# EAGLE design untitled (EAGLE 9.0.1)
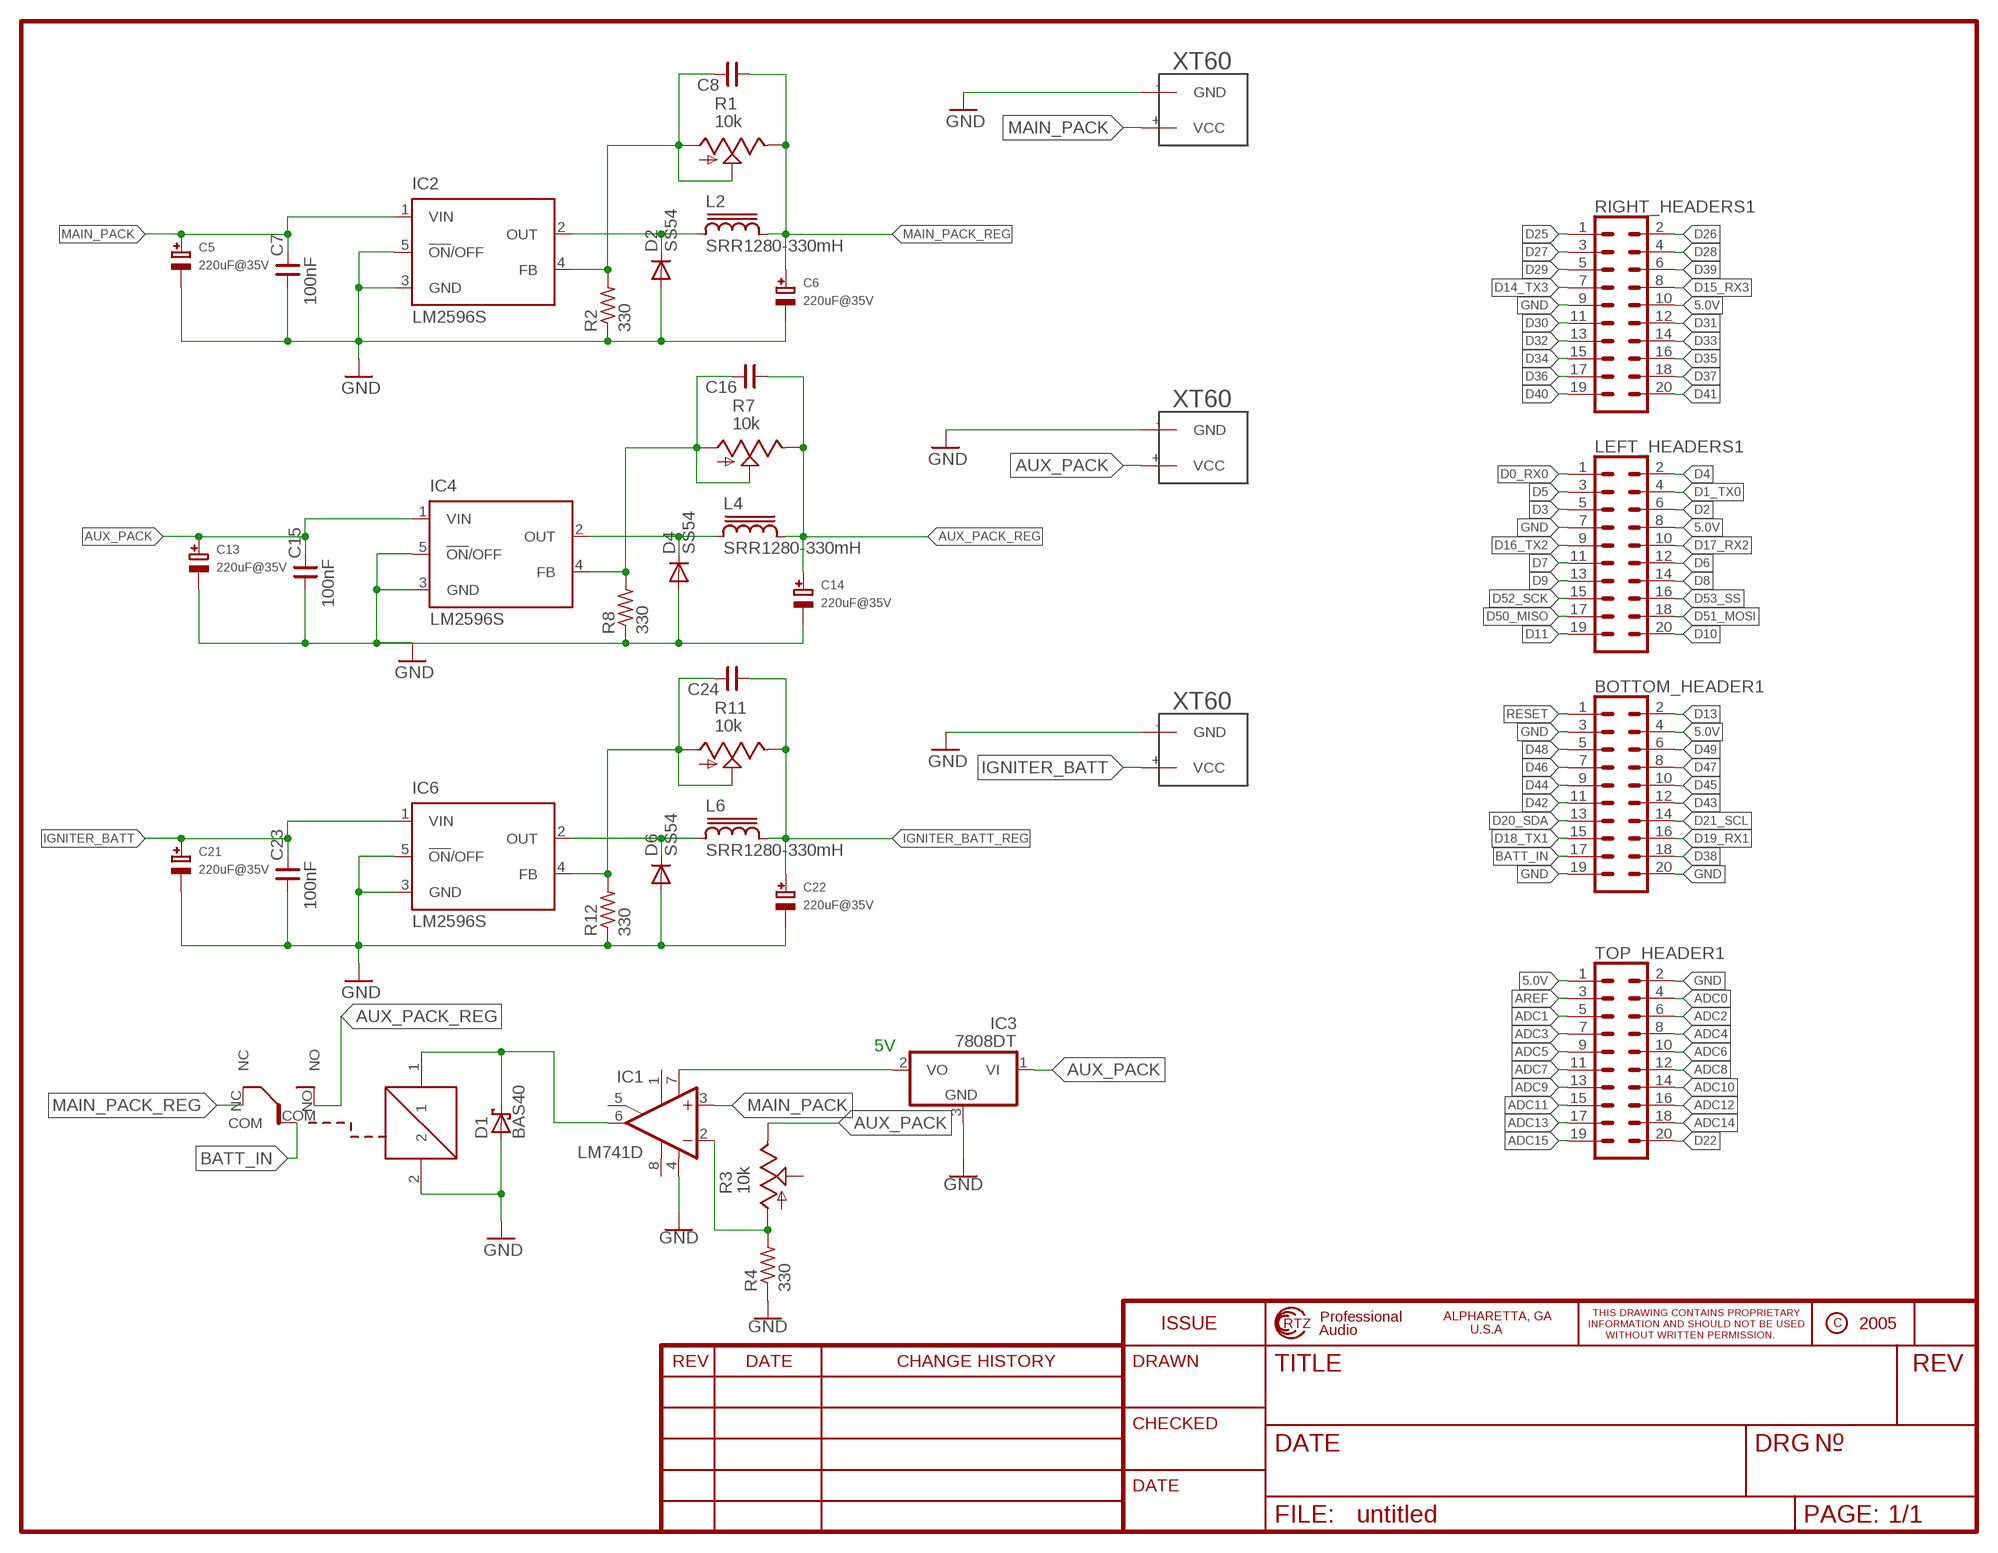
[diagram p0: schematic, sheet 1]

## Parts
BOTTOM_HEADER1  CONN_10X2  [2X10]
C5  220uF@35V  CAP_ELECTROLYTICPANASONIC_D  [PANASONIC_D]
C6  220uF@35V  CAP_ELECTROLYTICPANASONIC_D  [PANASONIC_D]
C7  100nF  CNP-0603  [0603]
C8  CNP-0603  [0603]
C13  220uF@35V  CAP_ELECTROLYTICPANASONIC_D  [PANASONIC_D]
C14  220uF@35V  CAP_ELECTROLYTICPANASONIC_D  [PANASONIC_D]
C15  100nF  CNP-0603  [0603]
C16  CNP-0603  [0603]
C21  220uF@35V  CAP_ELECTROLYTICPANASONIC_D  [PANASONIC_D]
C22  220uF@35V  CAP_ELECTROLYTICPANASONIC_D  [PANASONIC_D]
C23  100nF  CNP-0603  [0603]
C24  CNP-0603  [0603]
D1  BAS40  [SOT23]
D2  SS54  S3G  [DO214AB]
D4  SS54  S3G  [DO214AB]
D6  SS54  S3G  [DO214AB]
IC1  LM741D  [SO08]
IC2  LM2596S  [TO263-5]
IC3  7808DT  [TO252]
IC4  LM2596S  [TO263-5]
IC6  LM2596S  [TO263-5]
L2  SRR1280-330mH  SRR1280  [SRR1280]
L4  SRR1280-330mH  SRR1280  [SRR1280]
L6  SRR1280-330mH  SRR1280  [SRR1280]
LEFT_HEADERS1  CONN_10X2  [2X10]
R1  10k  TRIM_US-S64W  [S64W]
R2  330  R-US_R0603  [R0603]
R3  10k  TRIM_US-S64W  [S64W]
R4  330  R-US_R0603  [R0603]
R7  10k  TRIM_US-S64W  [S64W]
R8  330  R-US_R0603  [R0603]
R11  10k  TRIM_US-S64W  [S64W]
R12  330  R-US_R0603  [R0603]
RIGHT_HEADERS1  CONN_10X2  [2X10]
TOP_HEADER1  CONN_10X2  [2X10]
U$1  XT60  [XT60]
U$2  XT60  [XT60]
U$3  XT60  [XT60]
U$9  RW-SH  [RW-SH]

## Nets
5.0V: BOTTOM_HEADER1.4 LEFT_HEADERS1.8 RIGHT_HEADERS1.10 TOP_HEADER1.1
ADC0: TOP_HEADER1.4
ADC1: TOP_HEADER1.5
ADC2: TOP_HEADER1.6
ADC3: TOP_HEADER1.7
ADC4: TOP_HEADER1.8
ADC5: TOP_HEADER1.9
ADC6: TOP_HEADER1.10
ADC7: TOP_HEADER1.11
ADC8: TOP_HEADER1.12
ADC9: TOP_HEADER1.13
ADC10: TOP_HEADER1.14
ADC11: TOP_HEADER1.15
ADC12: TOP_HEADER1.16
ADC13: TOP_HEADER1.17
ADC14: TOP_HEADER1.18
ADC15: TOP_HEADER1.19
AREF: TOP_HEADER1.3
AUX_PACK: C13.+ C15.2 IC3.1(VI) IC4.1(VIN) R3.E U$2.+(VCC)
AUX_PACK_REG: C14.+ C16.1 L4.2 R7.E U$9.NO
BATT_IN: BOTTOM_HEADER1.17 D1.3(C) IC1.6(OUT) U$9.1 U$9.COM
D0_RX0: LEFT_HEADERS1.1
D1_TX0: LEFT_HEADERS1.4
D2: LEFT_HEADERS1.6
D3: LEFT_HEADERS1.5
D4: LEFT_HEADERS1.2
D5: LEFT_HEADERS1.3
D6: LEFT_HEADERS1.12
D7: LEFT_HEADERS1.11
D8: LEFT_HEADERS1.14
D9: LEFT_HEADERS1.13
D10: LEFT_HEADERS1.20
D11: LEFT_HEADERS1.19
D13: BOTTOM_HEADER1.2
D14_TX3: RIGHT_HEADERS1.7
D15_RX3: RIGHT_HEADERS1.8
D16_TX2: LEFT_HEADERS1.9
D17_RX2: LEFT_HEADERS1.10
D18_TX1: BOTTOM_HEADER1.15
D19_RX1: BOTTOM_HEADER1.16
D20_SDA: BOTTOM_HEADER1.13
D21_SCL: BOTTOM_HEADER1.14
D22: TOP_HEADER1.20
D25: RIGHT_HEADERS1.1
D26: RIGHT_HEADERS1.2
D27: RIGHT_HEADERS1.3
D28: RIGHT_HEADERS1.4
D29: RIGHT_HEADERS1.5
D30: RIGHT_HEADERS1.11
D31: RIGHT_HEADERS1.12
D32: RIGHT_HEADERS1.13
D33: RIGHT_HEADERS1.14
D34: RIGHT_HEADERS1.15
D35: RIGHT_HEADERS1.16
D36: RIGHT_HEADERS1.17
D37: RIGHT_HEADERS1.18
D38: BOTTOM_HEADER1.18
D39: RIGHT_HEADERS1.6
D40: RIGHT_HEADERS1.19
D41: RIGHT_HEADERS1.20
D42: BOTTOM_HEADER1.11
D43: BOTTOM_HEADER1.12
D44: BOTTOM_HEADER1.9
D45: BOTTOM_HEADER1.10
D46: BOTTOM_HEADER1.7
D47: BOTTOM_HEADER1.8
D48: BOTTOM_HEADER1.5
D49: BOTTOM_HEADER1.6
D50_MISO: LEFT_HEADERS1.17
D51_MOSI: LEFT_HEADERS1.18
D52_SCK: LEFT_HEADERS1.15
D53_SS: LEFT_HEADERS1.16
GND: BOTTOM_HEADER1.3 BOTTOM_HEADER1.19 BOTTOM_HEADER1.20 C13.- C14.- C15.1 C21.- C22.- C23.1 D1.1(A) D4.A D6.A IC1.4(V-) IC3.3(GND) IC4.3(GND) IC4.5(!ON!/OFF) IC6.3(GND) IC6.5(!ON!/OFF) LEFT_HEADERS1.7 R4.1 R8.1 R12.1 RIGHT_HEADERS1.9 TOP_HEADER1.2 U$1.-(GND) U$2.-(GND) U$3.-(GND) U$9.2
IGNITER_BATT: C21.+ C23.2 IC6.1(VIN) U$3.+(VCC)
IGNITER_BATT_REG: C22.+ C24.1 L6.2 R11.E
MAIN_PACK [MAIN_PACK]: C5.+ C5.- C6.- C7.1 C7.2 D2.A IC1.3(+IN) IC2.1(VIN) IC2.3(GND) IC2.5(!ON!/OFF) R2.1 U$1.+(VCC) ; supply symbol labelled GND
MAIN_PACK_REG: C6.+ C8.1 L2.2 R1.E U$9.NC
N$1: D2.C IC2.2(OUT) L2.1
N$2: C8.2 IC2.4(FB) R1.A R1.S R2.2
N$6: IC1.2(-IN) R3.A R4.2
N$7: D4.C IC4.2(OUT) L4.1
N$8: C16.2 IC4.4(FB) R7.A R7.S R8.2
N$9: IC1.7(V+) IC3.2(VO)
N$11: D6.C IC6.2(OUT) L6.1
N$12: C24.2 IC6.4(FB) R11.A R11.S R12.2
RESET: BOTTOM_HEADER1.1
Unconnected: IC1.1(ON1) IC1.5(ON2) IC1.8(OPT) R3.S

## Notes on the sheet
- 5V

## Library data of the parts
BOTTOM_HEADER1 LEFT_HEADERS1 RIGHT_HEADERS1 TOP_HEADER1 = SparkFun-Connectors:CONN_10X2: Multi connection point. Often used as Generic Header-pin footprint for 0.1 inch spaced/style header connections On any of the 0.1 inch spaced packages, you can populate with these: Break Away Headers - Straight <https://www.sparkfun.com/products/116> (PRT-00116) Break Away Male Headers - Right Angle <https://www.sparkfun.com/products/553> (PRT-00553) Female Headers <https://www.sparkfun.com/products/115> (PRT-00115) Break Away Headers - Machine Pin <https://www.sparkfun.com/products/117> (PRT-00117) Break Away Female Headers - Swiss Machine Pin <https://www.sparkfun.com/products/743> (PRT-00743) Special note about the "SPECIAL" package: This was SPECIALLY designed to be used with our Graphic LCD Backpack. Be sure you want to use this! It is not only staggered on each line of header holes, but IT IS ALSO offset of the center point of the top and bottom lines by 5 mil. This causes the headers to lock into place on the "standard" footprint on the LCD screen. The extra squares on the tdocu layer are there simply to reference other pins (if you were to actually populate a longer header than ten long - this is what we do with the backpacks).
C5 C6 C13 C14 C21 C22 = microbuilder:CAP_ELECTROLYTIC: Electrolytic Capacitors PANASONIC_C - Size C Panasonic Electrolytic Aluminum Capacitor 47µF 16V 20% Electrolytic Capacitor [Digikey: PCE3890TR-ND] PANASONIC_D - Size D Panasonic Electrolytic Aluminum Capacitor 100µF 25V 20% Electrolytic Capacitor [Digikey: PCE3898TR-ND]
C7 C8 C15 C16 C23 C24 = cap-master:CNP-: NON-POLARIZED CAP
D1 = diode:BAS40: Silicon Schottky Diodes General-purpose diode for high-speed switching
D2 D4 D6 = s3x_10:S3*: S3A - S3N General Purpose Rectifiers Source: http://www.fairchildsemi.com/datasheets/S3/S3A.pdf; MF: Fairchild; MPN: S3G; OC_FARNELL: 2454094; OC_NEWARK: 58K2397
IC1 = linear:*741: OP AMP
IC2 IC4 IC6 = national-semiconductor:LM2596: SIMPLE SWITCHER® Power Converter 150 kHz 3A Step-Down Voltage Regulator Source: http://www.national.com/ds/LM/LM2596.pdf; MF: NATIONAL SEMICONDUCTOR; MPN: LM2596S-ADJ/NOPB; OC_FARNELL: 9494367; OC_NEWARK: 41K3842
IC3 = adafruit:78*: Positive VOLTAGE REGULATOR Added bigger pads to the TO-92 package
L2 L4 L6 = inductor-bourns:SRR1280: POWER INDUCTOR
R1 R3 R7 R11 = pot:TRIM_US-: POTENTIOMETER
R2 R4 R8 R12 = adafruit:R-US_: RESISTOR, American symbol
U$1-U$3 = XT60:XT60: XT60
U$9 = goodsky1:RW-SH

## Net classes
0 default: width 0.203 mm, drill 0.254 mm, clearance 0.127 mm
1 16mil: width 0.254 mm, drill 0.254 mm, clearance 0.127 mm
2 MAIN_PACK: width 0.813 mm
3 32mil: width 0.254 mm, drill 0.254 mm, clearance 0.127 mm
4 AUX_PACK: width 0.813 mm
5 IGNITER_BATT: width 0.813 mm
6 MAIN_PACK_REG: width 0.813 mm
7 AUX_PACK_REG: width 0.813 mm
8 IGNITER_BATT_REG: width 0.813 mm

## Board
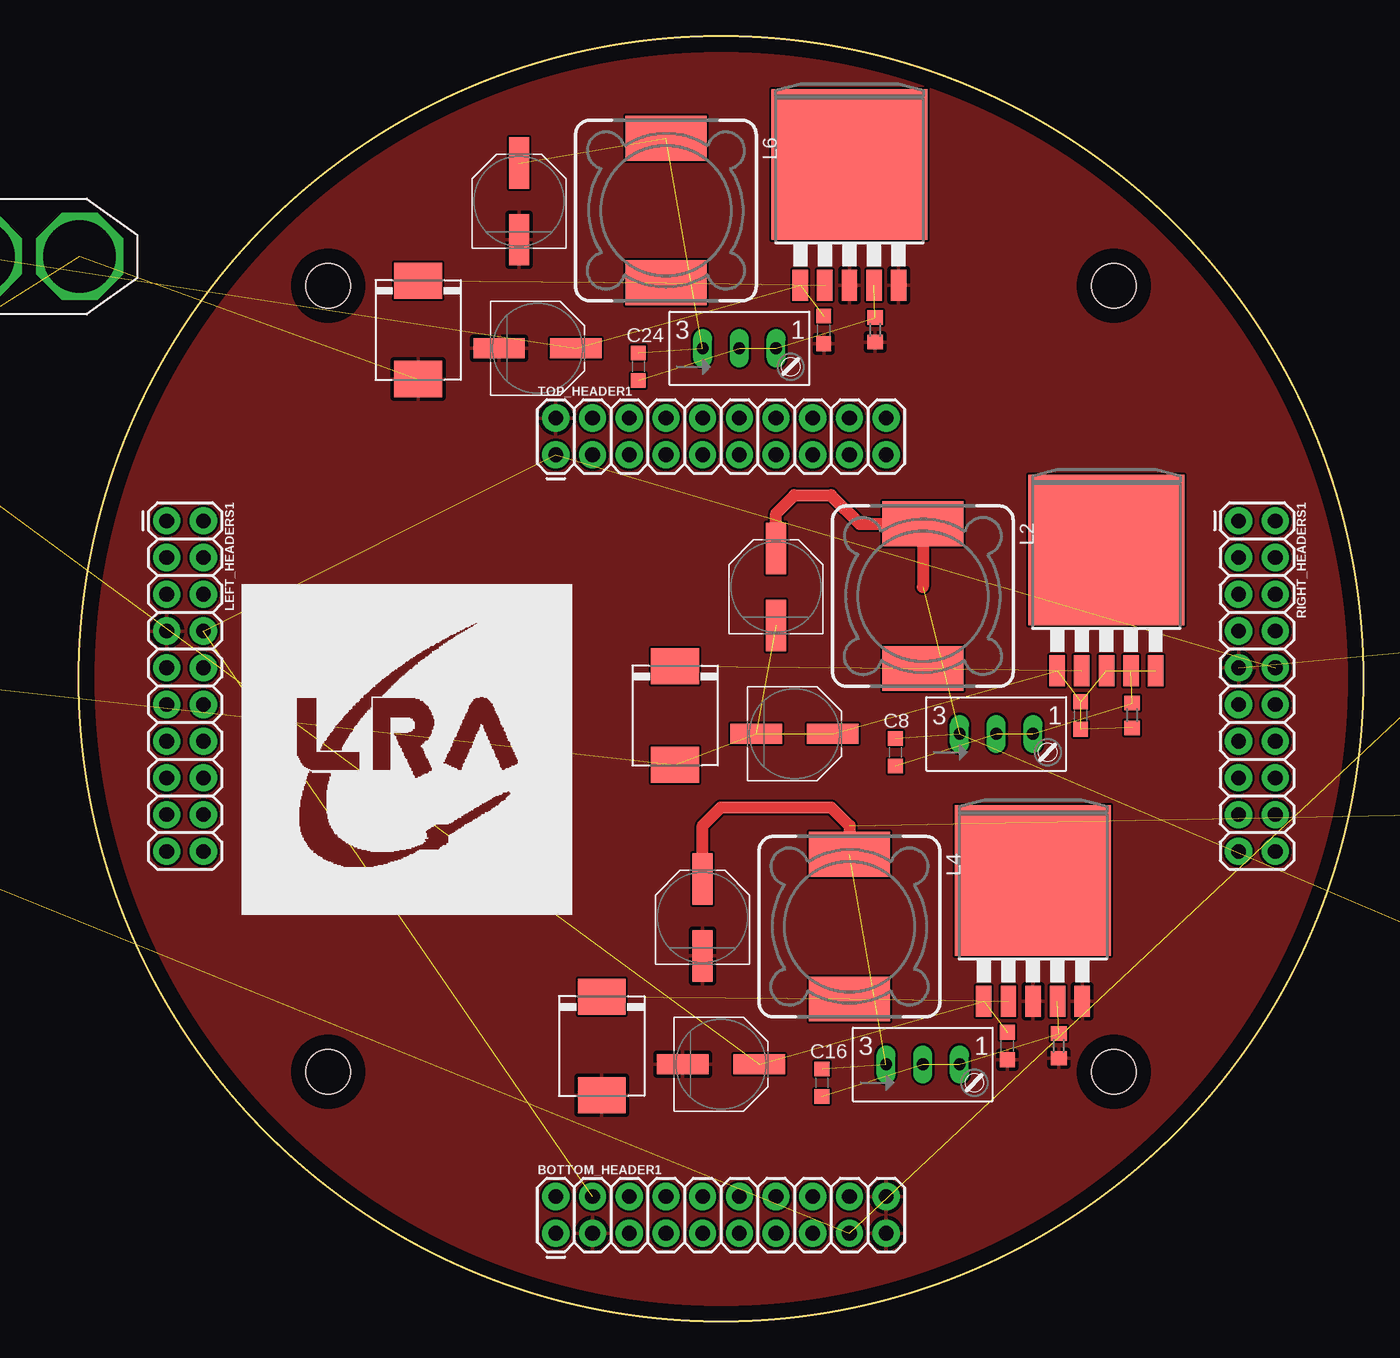
[diagram p1: board, top side]
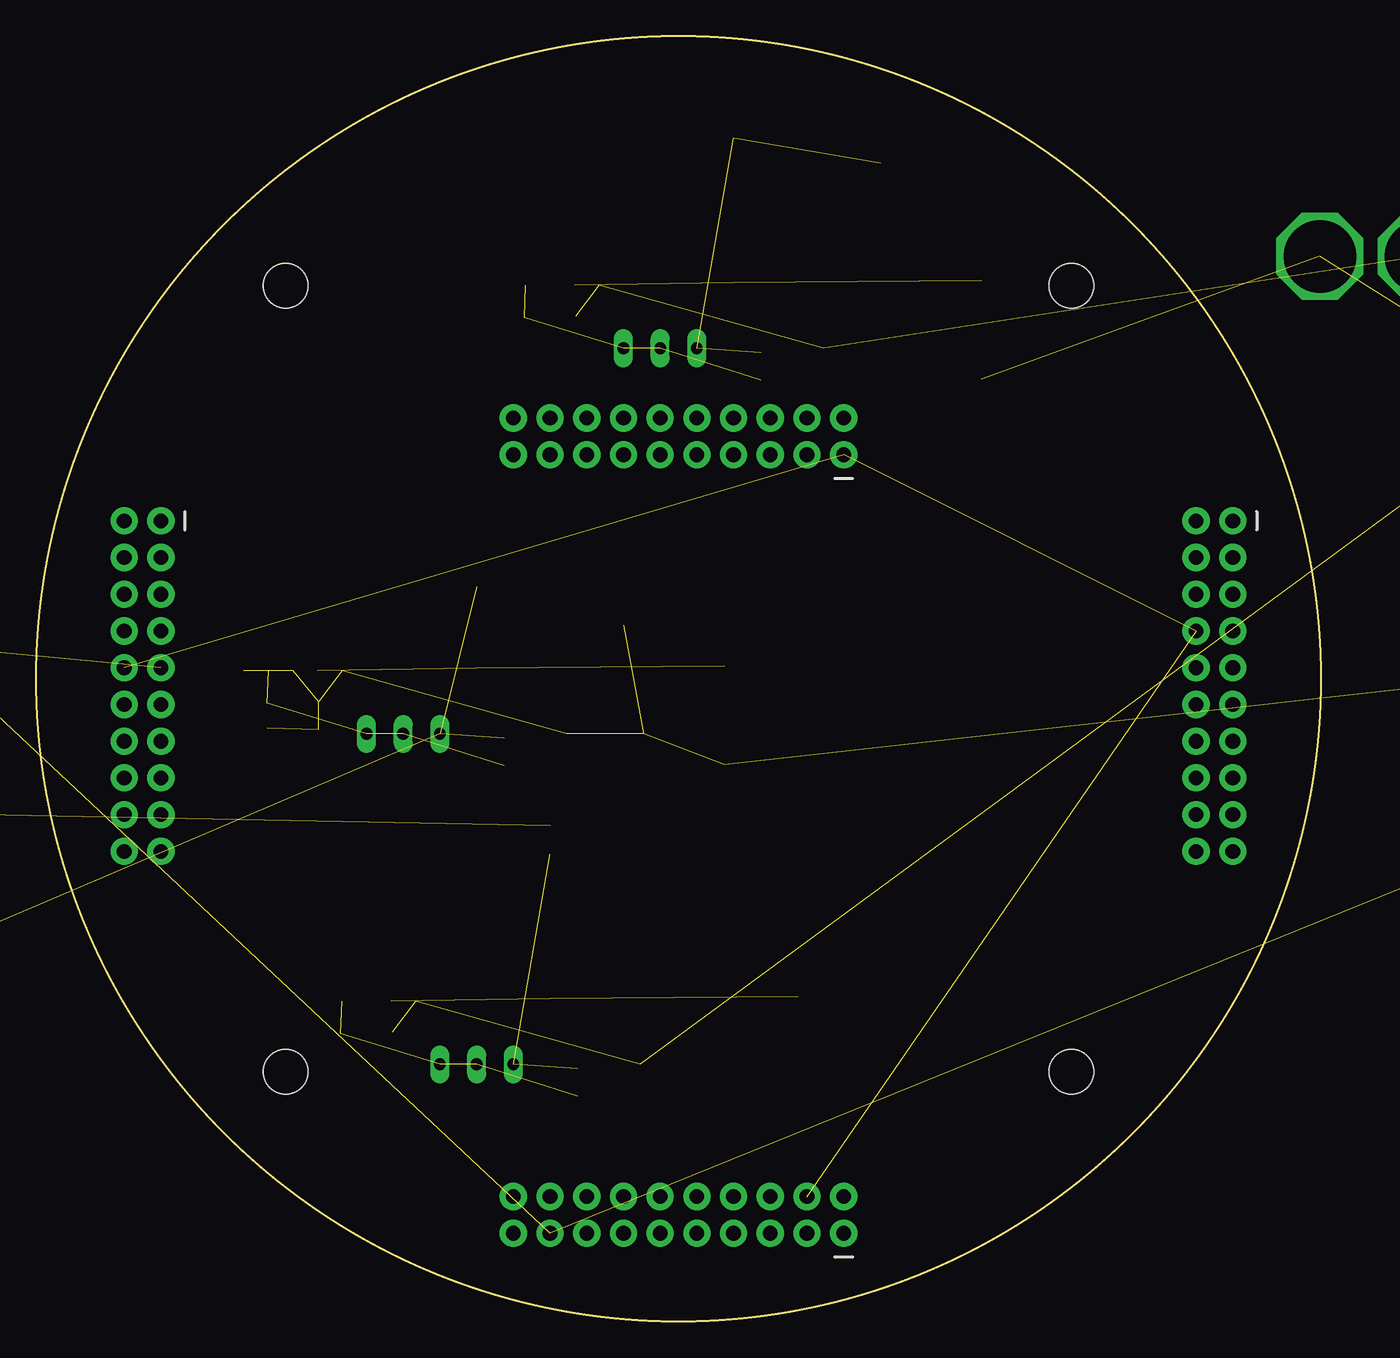
[diagram p2: board, bottom side, seen from below]

Size 88.9 x 88.9 mm. Coordinates in mm from the lower left corner, seen from the top.
Outline: circle at 44.45,44.45 radius 44.45
Copper layers (1*16): Top 0.035mm / dielectric 1.5mm / Bottom 0.035mm
Design rules "default": minimum track width 6mil, minimum drill 0.35mm, track to track 6mil, track to pad 6mil, pad to pad 6mil, via to via 6mil, smd to smd 6mil, copper to edge 40mil, drill to drill 6mil, minimum pad ring 10mil, minimum via ring 8mil, stop-mask expansion 4mil, vias tented up to drill 0mil, thermal gap 10mil
Holes 3.07 mm at 17.27,17.27 71.63,17.27 71.63,71.63 17.27,71.63

### Footprints (pad centres in the part's own frame; a part is rotated, then mirrored left to right if it is on the bottom)
2X10 = drill 1.016 pad 1.88: 1 0,0; 2 0,2.54; 3 2.54,0; 4 2.54,2.54; 5 5.08,0; 6 5.08,2.54; 7 7.62,0; 8 7.62,2.54; 9 10.16,0; 10 10.16,2.54; 11 12.7,0; 12 12.7,2.54; 13 15.24,0; 14 15.24,2.54; 15 17.78,0; 16 17.78,2.54; 17 20.32,0; 18 20.32,2.54; 19 22.86,0; 20 22.86,2.54
PANASONIC_D = smd 3.556 x 1.4: + 2.654,0; - -2.654,0
0603 = smd 1.016 x 1.016: 1 -0.953,0; 2 0.953,0
SOT23 = smd 1 x 1.4: 1 -0.95,-1.1; 2 0.95,-1.1; 3 0,1.1
DO214AB = smd 2.5 x 3.3: A 3.4,0; C -3.4,0
SO08 = smd 0.6 x 2.2: 1 -1.905,-2.6; 2 -0.635,-2.6; 3 0.635,-2.6; 4 1.905,-2.6; 5 1.905,2.6; 6 0.635,2.6; 7 -0.635,2.6; 8 -1.905,2.6
TO263-5 = smd 1.067 x 2.159: 1 -3.404,-5.791; 2 -1.702,-5.791; 3 0,-5.791; 4 1.702,-5.791; 5 3.404,-5.791 | smd 10.8 x 10.41: 6 0,2.54
TO252 = smd 1 x 1.6: 1 -2.28,-4.8; 2 2.28,-4.8 | smd 5.4 x 6.2: 3 0,2.5
SRR1280 = smd 5.6 x 3.1: 1 0.635,5; 2 0.635,-5
S64W = drill 0.813 long: A 2.54,1.27; E -2.54,1.27; S 0,1.27
R0603 = smd 1 x 1.1: 1 -0.85,0; 2 0.85,0
XT60 = drill 5 octagon: + 4.5,0; - 11.5,0
RW-SH = drill 1.5: 1 -6.1,6; 2 -6.1,-6; COM -8.1,0; NC 6.1,6; NO 6.1,-6

### Placement (x,y rotation side)
BOTTOM_HEADER1  33.02,6.1 0 top
C5  49.53,40.64 0 top
C6  48.26,50.8 90 top
C7  69.34,41.91 90 top
C8  56.52,39.37 270 top
C13  44.45,17.78 0 top
C14  43.18,27.94 90 top
C15  64.26,19.05 90 top
C16  51.44,16.51 270 top
C21  31.75,67.31 0 top
C22  30.48,77.47 90 top
C23  51.56,68.58 90 top
C24  38.73,66.04 270 top
D1  99.31,48.01 0 top  (outside the outline)
D2  41.27,41.91 270 top
D4  36.2,19.05 270 top
D6  23.5,68.58 270 top
IC1  -60.96,49.53 0 top  (outside the outline)
IC2  71.12,50.8 0 top
IC3  -33.02,63.5 0 top  (outside the outline)
IC4  66.04,27.94 0 top
IC6  53.34,77.47 0 top
L2  59.05,50.16 180 top
L4  53.98,27.3 180 top
L6  41.27,76.83 180 top
LEFT_HEADERS1  6.1,55.37 270 top
R1  63.5,39.37 0 top
R2  72.9,41.91 90 top
R3  -17.78,66.04 0 top  (outside the outline)
R4  -25.4,57.15 0 top  (outside the outline)
R7  58.42,16.51 0 top
R8  67.82,19.05 90 top
R11  45.72,66.04 0 top
R12  55.12,68.58 90 top
RIGHT_HEADERS1  80.26,55.37 270 top
TOP_HEADER1  33.02,59.94 0 top
U$1  -39.37,46.99 0 top  (outside the outline)
U$2  -45.72,77.47 0 top  (outside the outline)
U$3  -11.43,73.66 0 top
U$9  107.95,29.21 180 top  (outside the outline)

### Tracks (layer width: path | path; a pad name or v marks a point on that pad's centre or on a via)
5.0V  (3 unrouted)
AUX_PACK  (5 unrouted)
AUX_PACK_REG  (3 unrouted)
  Top 0.813: C14.+ 43.18,34.29 44.45,35.56 52.07,35.56 53.34,34.29 L4.2
BATT_IN  (4 unrouted)
GND  (8 unrouted)
  pour Top: 44.45,0 arc90 88.9,44.45 arc90 44.45,88.9 arc90 0,44.45 arc90
IGNITER_BATT  (3 unrouted)
IGNITER_BATT_REG  (3 unrouted)
MAIN_PACK  (11 unrouted)
MAIN_PACK_REG  (3 unrouted)
  Top 0.813: C6.+ 48.26,55.88 49.53,57.15 52.07,57.15 54.05,55.16 L2.2 58.42,50.8
N$1  (2 unrouted)
N$2  (4 unrouted)
N$6  (2 unrouted)
N$7  (2 unrouted)
N$8  (4 unrouted)
N$9  (1 unrouted)
N$11  (2 unrouted)
N$12  (4 unrouted)